# EAGLE design ADS1232 interface (EAGLE 9.6.2)
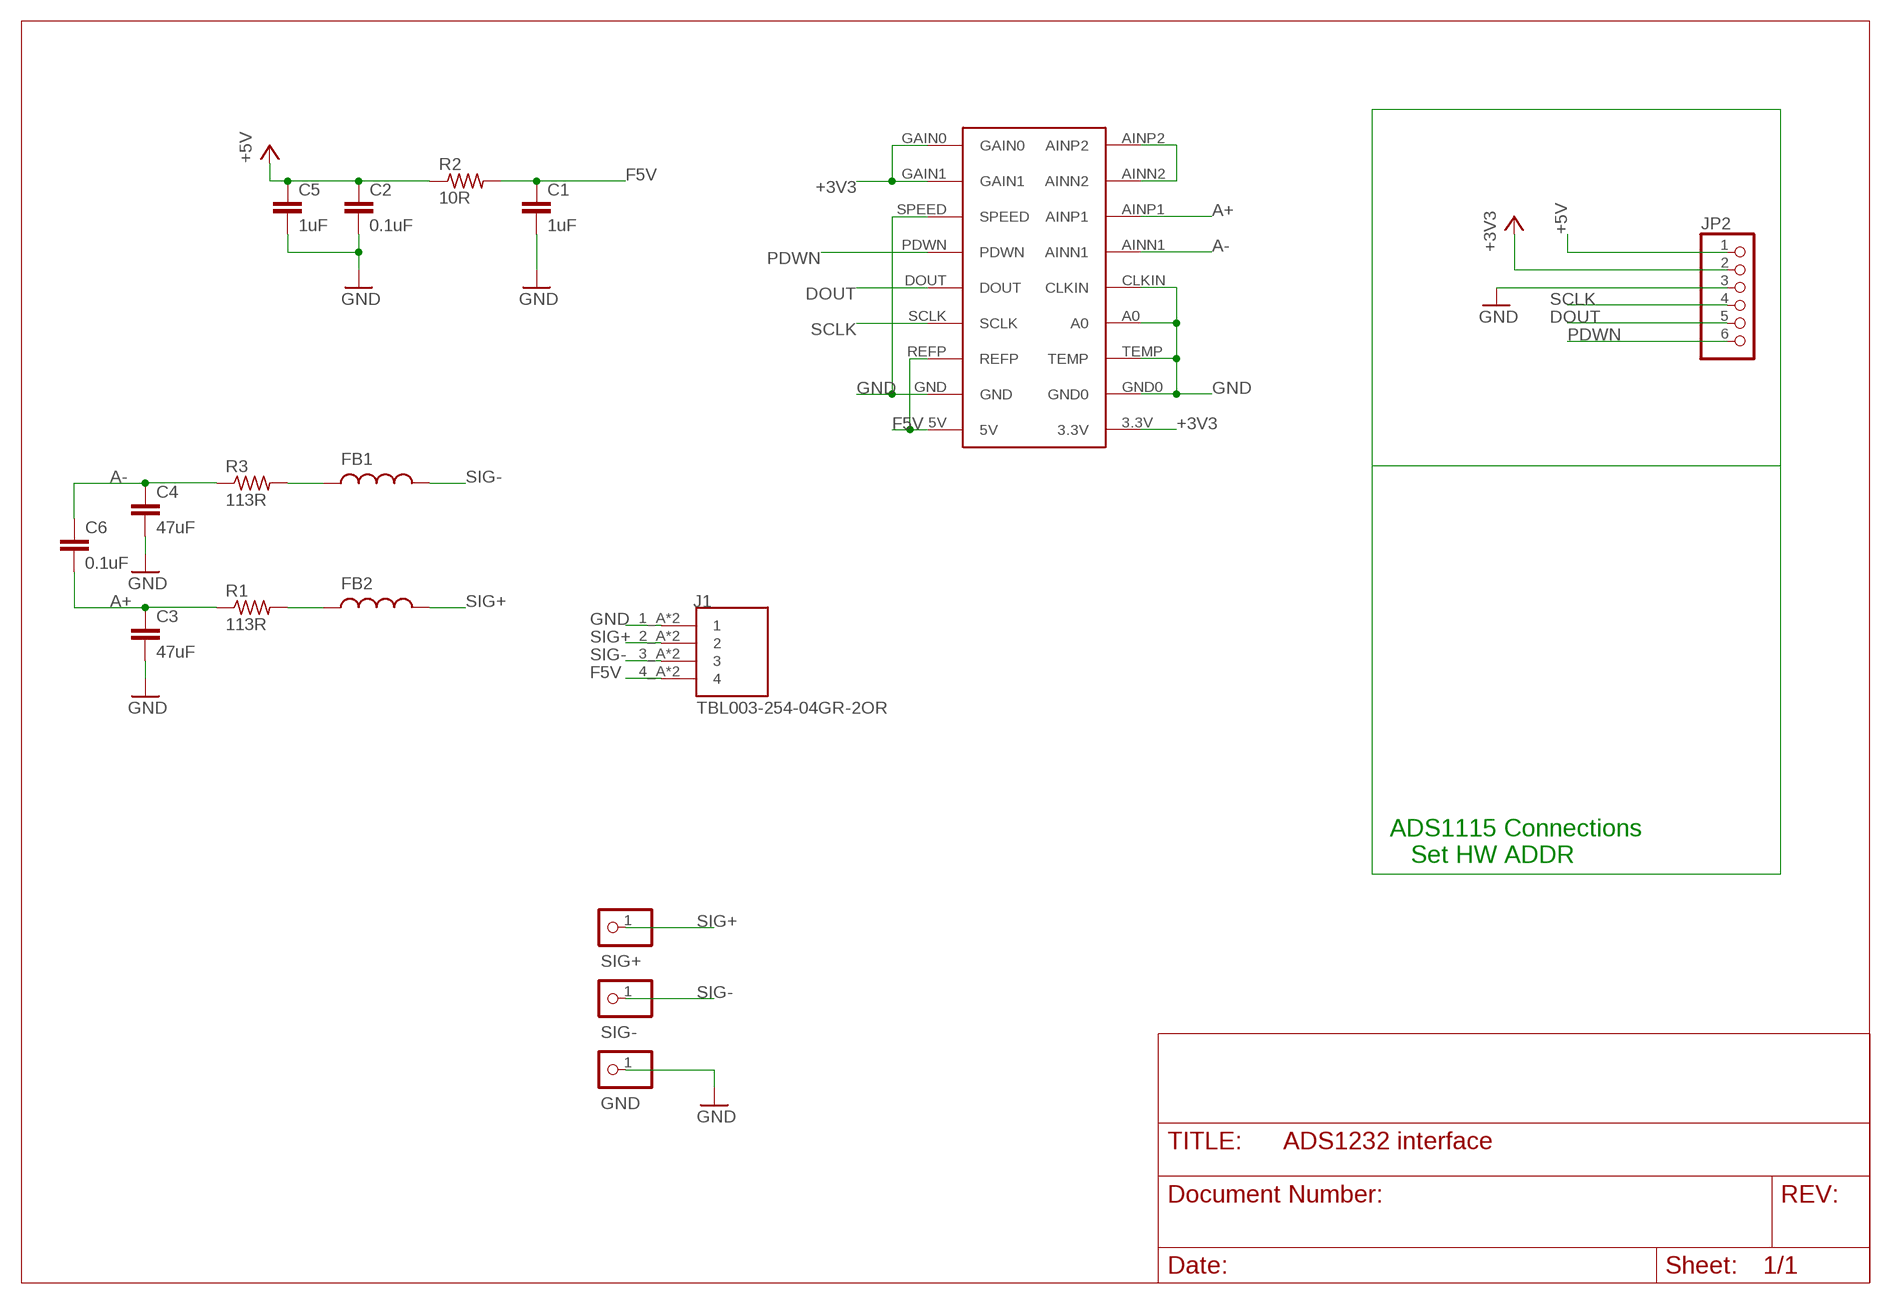
[diagram p0: schematic, sheet 1]

## Parts
ADS1232  ADS1232  [ADS1232]
C1  1uF  C-EUC0805  [C0805]
C2  0.1uF  C-EUC0805  [C0805]
C3  47uF  C-EUC0805  [C0805]
C4  47uF  C-EUC0805  [C0805]
C5  1uF  C-EUC0805  [C0805]
C6  0.1uF  C-EUC0805  [C0805]
FB1  WE-RFI_0805A_744760282A  [WE-RFI_0805A]
FB2  WE-RFI_0805A_744760282A  [WE-RFI_0805A]
GND  PINHD-1X1  [1X01]
J1  TBL003-254-04GR-2OR  [CUI_TBL003-254-04GR-2OR]
JP2  PINHD-1X6  [1X06]
R1  113R  R-US_R0805  [R0805]
R2  10R  R-US_R0805  [R0805]
R3  113R  R-US_R0805  [R0805]
SIG+  PINHD-1X1  [1X01]
SIG-  PINHD-1X1  [1X01]

## Nets
+3V3: ADS1232.3.3V ADS1232.GAIN0 ADS1232.GAIN1 JP2.2
+5V: C2.1 C5.1 JP2.1 R2.1
A+: ADS1232.AINP1 C3.1 C6.2 R1.1
A-: ADS1232.AINN1 C4.1 C6.1 R3.1
DOUT: ADS1232.DOUT JP2.5
F5V: ADS1232.5V ADS1232.REFP C1.1 J1.4_A J1.4_B R2.2
GND: ADS1232.A0 ADS1232.AINN2 ADS1232.AINP2 ADS1232.CLKIN ADS1232.GND ADS1232.GND0 ADS1232.SPEED ADS1232.TEMP C1.2 C2.2 C3.2 C4.2 C5.2 GND.1 J1.1_A J1.1_B JP2.3
N$4: FB1.1 R3.2
N$5: FB2.1 R1.2
PDWN: ADS1232.PDWN JP2.6
SCLK: ADS1232.SCLK JP2.4
SIG+: FB2.2 J1.2_A J1.2_B SIG+.1
SIG-: FB1.2 J1.3_A J1.3_B SIG-.1

## Notes on the sheet
- ADS1115 Connections
     Set HW ADDR

## Library data of the parts
ADS1232 = my_lib:ADS1232
C1-C6 = rcl:C-EU: CAPACITOR, European symbol; SPICEPREFIX: C
FB1 FB2 = Wurth_Elektronik_Passive_rev19e:WE-RFI_0805A: Ferrite SMD Inductor Characteristics High thermal stability Operating temperature: –40 °C to +85 °C Applications Especially developed for RF applications RFID Low frequency radio applications (Keyless) <http://katalog.we-online.de/media/images/v2/Family_WE-RFI.jpg> Details see: http://katalog.we-online.de/en/pbs/WE-RFI? Updated by Dan Xu 2014-07-08 2014 (C) Wurth Elektronik; WE-NUMBER: 744760282A/0,82uH
GND SIG+ SIG- = pinhead:PINHD-1X1: PIN HEADER
J1 = TBL003-254-04GR-2OR:TBL003-254-04GR-2OR; AVAILABILITY: Unavailable; CUI_PURCHASE_URL: https://www.cuidevices.com/product/interconnect/connectors/terminal-blocks/tbl003-254-series?utm_source=snapeda.com&utm_medium=referral&utm_campaign=snapedaBOM; DESCRIPTION: 1~24 Poles, Screwless, Horizontal, 2.54 Pitch, 24~20 (AWG), Terminal Block Connector; MF: CUI Devices; MP: TBL003-254-04GR-2OR; PACKAGE: None; PRICE: None
JP2 = adafruit:PINHD-1X6: PIN HEADER
R1-R3 = rcl:R-US_: RESISTOR, American symbol; SPICEPREFIX: R

## Board
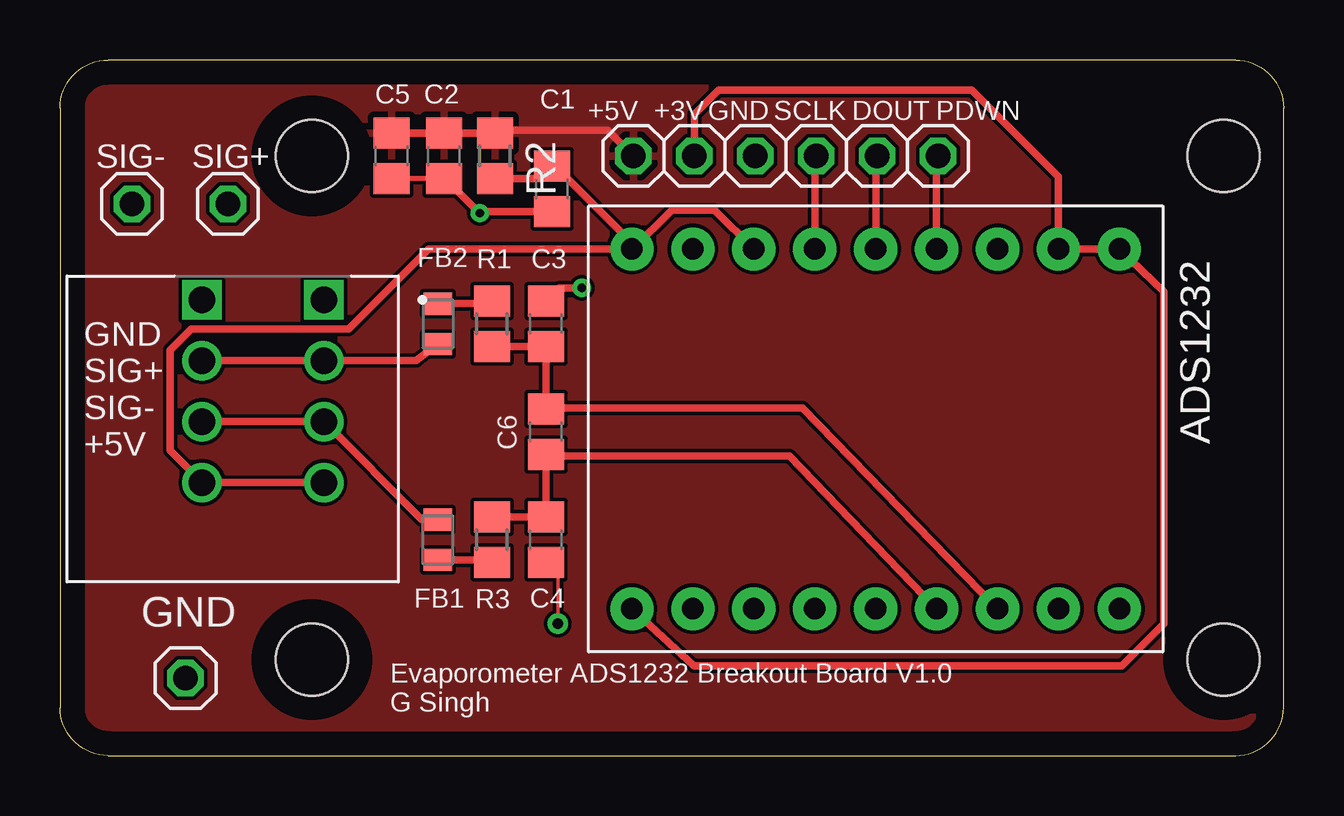
[diagram p1: board, top side]
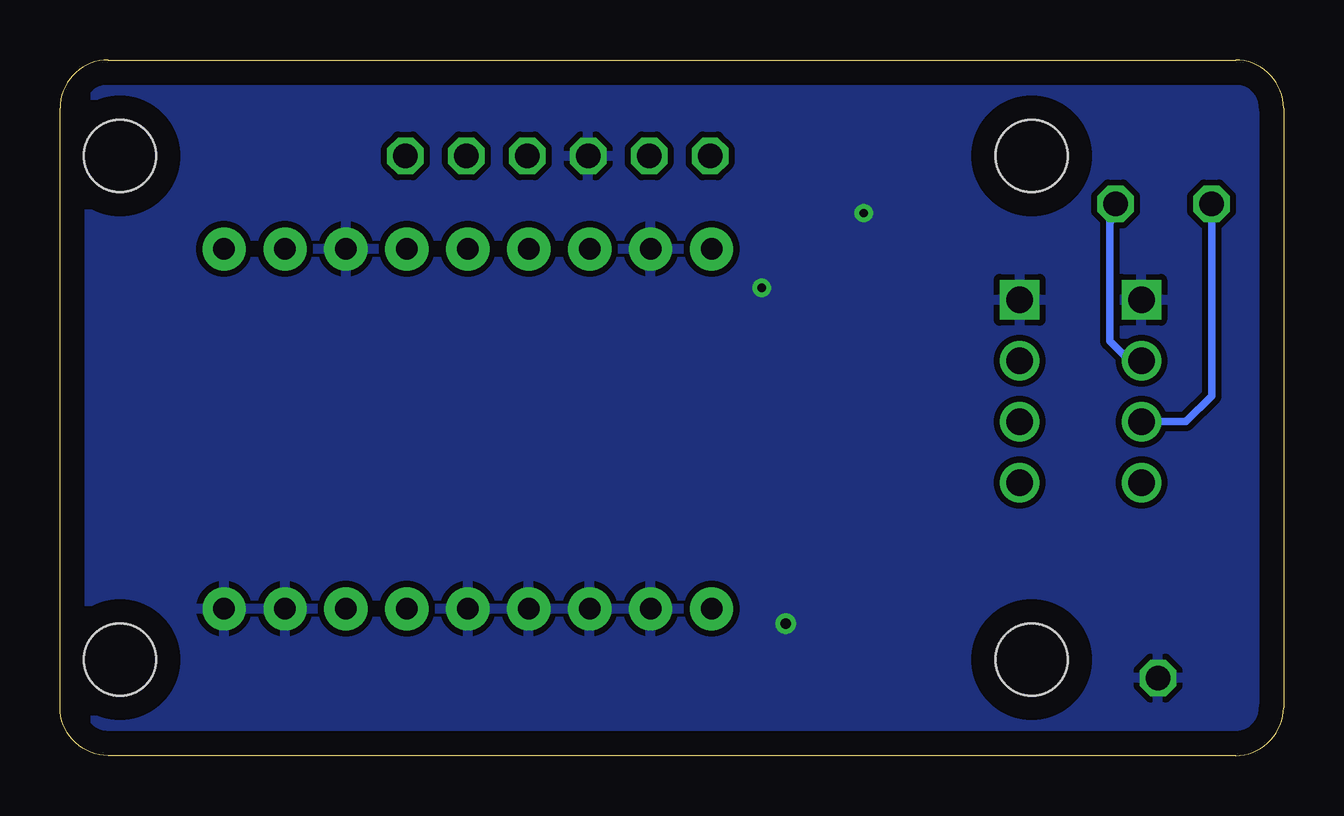
[diagram p2: board, bottom side, seen from below]

Size 51 x 29 mm. Coordinates in mm from the lower left corner, seen from the top.
Outline: 2,0 49,0 arc90 51,2 51,27 arc90 49,29 2,29 arc90 0,27 0,2 arc90 2,0
Copper layers (1*16): Top 0.035mm / dielectric 1.5mm / Bottom 0.035mm
Design rules "default *": minimum track width 6mil, minimum drill 0.35mm, track to track 6mil, track to pad 6mil, pad to pad 6mil, via to via 6mil, smd to smd 6mil, copper to edge 40mil, drill to drill 6mil, minimum pad ring 10mil, minimum via ring 8mil, stop-mask expansion 4mil, vias tented up to drill 35mil, thermal gap 10mil
Holes 3 mm at 10.5,25 48.5,25 10.5,4 48.5,4

### Footprints (pad centres in the part's own frame; a part is rotated, then mirrored left to right if it is on the bottom)
ADS1232 = drill 0.9 pad 1.8: 3.3V 7.38,-10.16; 5V -7.62,-10.16; A0 7.38,-2.54; AINN1 7.38,2.54; AINN2 7.38,7.62; AINP1 7.38,5.08; AINP2 7.38,10.16; CLKIN 7.38,0; DOUT -7.62,0; GAIN0 -7.62,10.16; GAIN1 -7.62,7.62; GND -7.62,-7.62; GND0 7.38,-7.62; PDWN -7.62,2.54; REFP -7.62,-5.08; SCLK -7.62,-2.54; SPEED -7.62,5.08; TEMP 7.38,-5.08
C0805 = smd 1.3 x 1.5: 1 -0.95,0; 2 0.95,0
WE-RFI_0805A = smd 0.925 x 1.2: 1 -0.838,0; 2 0.838,0
1X01 = drill 1.016 octagon: 1 0,0
CUI_TBL003-254-04GR-2OR = drill 1.1 square: 1_A 0,0; 1_B 0,-5.08 | drill 1.1: 2_A 2.54,0; 2_B 2.54,-5.08; 3_A 5.08,0; 3_B 5.08,-5.08; 4_A 7.62,0; 4_B 7.62,-5.08
1X06 = drill 1.016 octagon: 1 -6.35,0; 2 -3.81,0; 3 -1.27,0; 4 1.27,0; 5 3.81,0; 6 6.35,0
R0805 = smd 1.3 x 1.5: 1 -0.95,0; 2 0.95,0

### Placement (x,y rotation side)
ADS1232  34,13.5 270 top
C1  20.5,23.62 270 top
C2  16,25 270 top
C3  20.25,18 90 top
C4  20.25,9 270 top
C5  13.82,25 270 top
C6  20.25,13.5 90 top
FB1  15.75,9 90 top
FB2  15.75,18 270 top
GND  5.23,3.23 0 top
J1  11,19 270 top
JP2  30.25,25 0 top
R1  18,18 90 top
R2  18.12,25 270 top
R3  18,9 270 top
SIG+  7,23 0 top
SIG-  3,23 0 top

### Tracks (layer width: path | path; a pad name or v marks a point on that pad's centre or on a via)
+3V3
  Top 0.305: ADS1232.3.3V 26.44,3.75 44.25,3.75 46,5.5 46,19.34 ADS1232.GAIN0 ADS1232.GAIN1 41.62,24.13 38,27.75 27.44,27.75 26.44,26.75 JP2.2
+5V
  Top 0.305: C5.1 C2.1 16.02,25.98 16.05,25.95 R2.1 18.25,26.08 22.82,26.08 JP2.1
  pour Top: 52.5,31 52.5,-1 -2,-1 -2,31
A+
  Top 0.305: R1.1 C3.1 20.25,14.5 | 20.25,14.5 C6.2 | ADS1232.AINP1 30.95,14.5 20.25,14.5
A-
  Top 0.305: R3.1 C4.1 20.25,12.5 | 20.25,12.5 C6.1 | ADS1232.AINN1 30.41,12.5 20.25,12.5
DOUT
  Top 0.305: ADS1232.DOUT 34,24.94 JP2.5
F5V
  Top 0.305: J1.4_A J1.4_B 4.59,12.71 4.59,16.91 5.47,17.79 12.04,17.79 15.37,21.12 ADS1232.5V | ADS1232.5V 23.84,21.36 20.55,24.65 C1.1 19.98,24.05 R2.2 | ADS1232.REFP 27.29,22.75 25.5,22.75 23.87,21.12 ADS1232.5V
GND  (via drill 0.35, 0.45)
  Top 0.152: C4.2 20.75,8.1 v20.75,5.5
  Top 0.203: C2.2 C5.2
  Top 0.305: C2.2 16.24,23.87 v17.5,22.61 17.56,22.68 C1.2 | v21.75,19.5 20.8,19.5 C3.2
  pour Bottom (isolate 0.254): -1,30 52.5,30 52.5,-1 -1,-1
N$4
  Top 0.305: FB1.1 17.89,8.16 R3.2
N$5
  Top 0.305: FB2.1 17.89,18.84 R1.2
PDWN
  Top 0.305: ADS1232.PDWN 36.54,24.94 JP2.6
SCLK
  Top 0.305: ADS1232.SCLK 31.46,24.94 JP2.4
SIG+
  Top 0.305: FB2.2 14.85,16.46 J1.2_A J1.2_B
  Bottom 0.305: SIG+.1 7,22.5 7.25,22.25 7.25,17.29 6.42,16.46 J1.2_B
SIG-
  Top 0.305: J1.3_B J1.3_A 15.08,9.84 FB1.2
  Bottom 0.305: SIG-.1 3,15 4.08,13.92 J1.3_B

### Text on the board
tPlace: GND / SIG+ / SIG- / +5V | Evaporometer ADS1232 Breakout Board V1.0 / G Singh
tNames: +5V | +3V | GND | SCLK | DOUT | PDWN